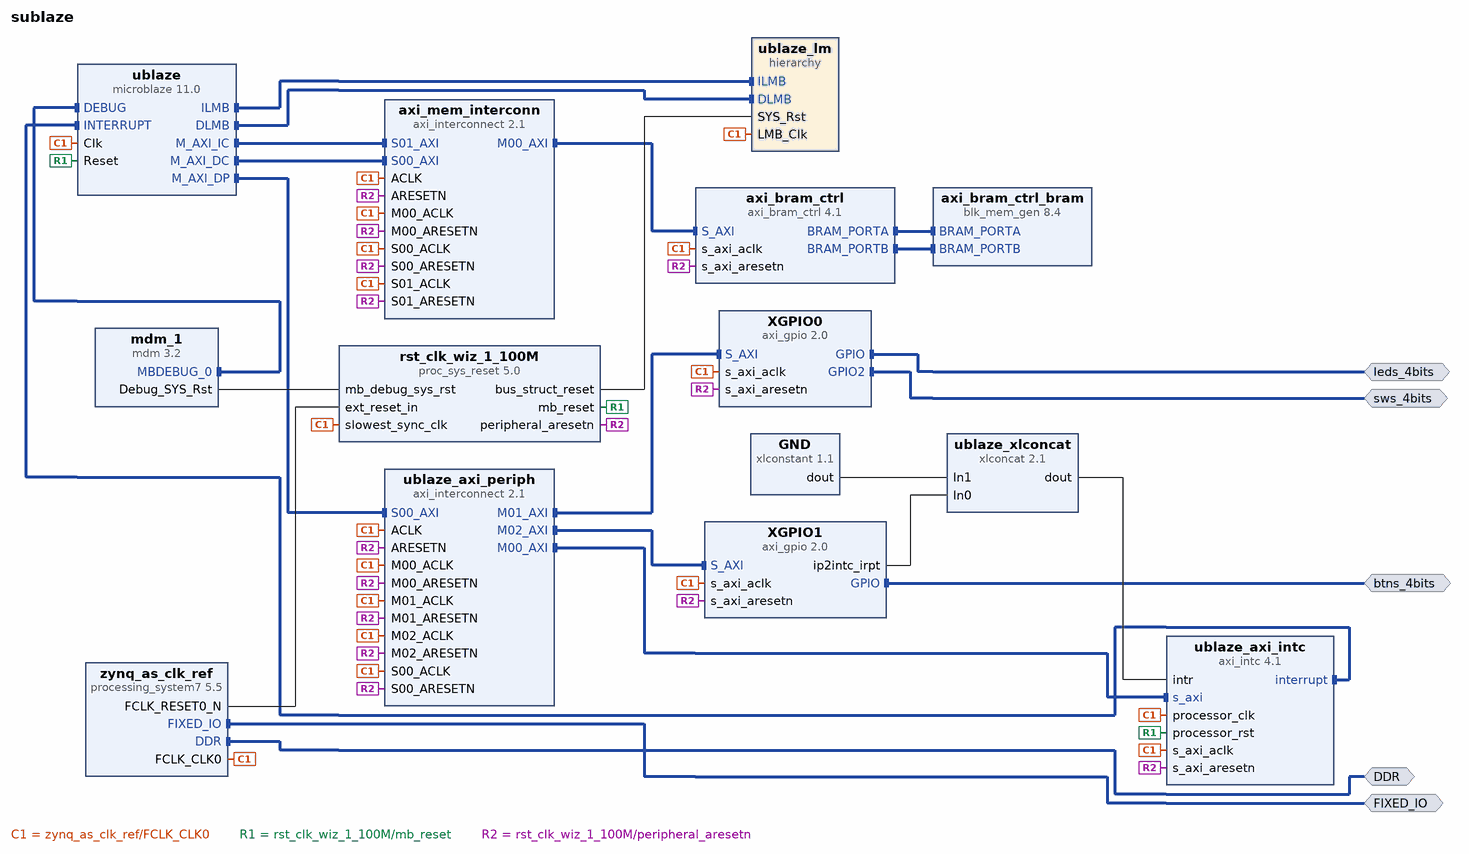
[diagram p0: block diagram of the top level]
# Vivado block design sublaze, xc7z010clg400-1, Vivado 2019.2
create_bd_design sublaze

create_bd_intf_port -mode Master -vlnv xilinx.com:interface:ddrx_rtl:1.0 DDR
create_bd_intf_port -mode Master -vlnv xilinx.com:display_processing_system7:fixedio_rtl:1.0 FIXED_IO
create_bd_intf_port -mode Master -vlnv xilinx.com:interface:gpio_rtl:1.0 sws_4bits
create_bd_intf_port -mode Master -vlnv xilinx.com:interface:gpio_rtl:1.0 leds_4bits
create_bd_intf_port -mode Master -vlnv xilinx.com:interface:gpio_rtl:1.0 btns_4bits

create_bd_cell -type ip -vlnv xilinx.com:ip:microblaze:11.0 ublaze
set_property -dict [list \
  CONFIG.C_ADDR_TAG_BITS 1 \
  CONFIG.C_CACHE_BYTE_SIZE 8192 \
  CONFIG.C_DCACHE_ADDR_TAG 1 \
  CONFIG.C_DCACHE_BYTE_SIZE 8192 \
  CONFIG.C_DCACHE_USE_WRITEBACK 1 \
  CONFIG.C_DEBUG_ENABLED 1 \
  CONFIG.C_DIV_ZERO_EXCEPTION 1 \
  CONFIG.C_D_AXI 1 \
  CONFIG.C_D_LMB 1 \
  CONFIG.C_FPU_EXCEPTION 1 \
  CONFIG.C_ICACHE_LINE_LEN 8 \
  CONFIG.C_ICACHE_STREAMS 1 \
  CONFIG.C_ICACHE_VICTIMS 8 \
  CONFIG.C_ILL_OPCODE_EXCEPTION 1 \
  CONFIG.C_I_LMB 1 \
  CONFIG.C_M_AXI_D_BUS_EXCEPTION 1 \
  CONFIG.C_M_AXI_I_BUS_EXCEPTION 1 \
  CONFIG.C_NUMBER_OF_PC_BRK 2 \
  CONFIG.C_NUMBER_OF_RD_ADDR_BRK 1 \
  CONFIG.C_NUMBER_OF_WR_ADDR_BRK 1 \
  CONFIG.C_OPCODE_0x0_ILLEGAL 1 \
  CONFIG.C_PVR 2 \
  CONFIG.C_UNALIGNED_EXCEPTIONS 1 \
  CONFIG.C_USE_BARREL 1 \
  CONFIG.C_USE_DCACHE 1 \
  CONFIG.C_USE_DIV 1 \
  CONFIG.C_USE_FPU 1 \
  CONFIG.C_USE_HW_MUL 2 \
  CONFIG.C_USE_ICACHE 1 \
  CONFIG.C_USE_MMU 0 \
  CONFIG.C_USE_MSR_INSTR 1 \
  CONFIG.C_USE_PCMP_INSTR 1 \
  CONFIG.G_TEMPLATE_LIST 10 \
  CONFIG.G_USE_EXCEPTIONS 1 \
] [get_bd_cells ublaze]
create_bd_cell -type hier ublaze_lm
create_bd_cell -type ip -vlnv xilinx.com:ip:axi_interconnect:2.1 ublaze_axi_periph
set_property -dict {CONFIG.NUM_MI 3} [get_bd_cells ublaze_axi_periph]
create_bd_cell -type ip -vlnv xilinx.com:ip:axi_intc:4.1 ublaze_axi_intc
set_property -dict {CONFIG.C_HAS_FAST 1 CONFIG.C_IRQ_IS_LEVEL 0} [get_bd_cells ublaze_axi_intc]
create_bd_cell -type ip -vlnv xilinx.com:ip:xlconcat:2.1 ublaze_xlconcat
create_bd_cell -type ip -vlnv xilinx.com:ip:mdm:3.2 mdm_1
create_bd_cell -type ip -vlnv xilinx.com:ip:proc_sys_reset:5.0 rst_clk_wiz_1_100M
create_bd_cell -type ip -vlnv xilinx.com:ip:axi_interconnect:2.1 axi_mem_interconn
set_property -dict {CONFIG.NUM_MI 1 CONFIG.NUM_SI 2} [get_bd_cells axi_mem_interconn]
create_bd_cell -type ip -vlnv xilinx.com:ip:axi_bram_ctrl:4.1 axi_bram_ctrl
create_bd_cell -type ip -vlnv xilinx.com:ip:blk_mem_gen:8.4 axi_bram_ctrl_bram
set_property -dict {CONFIG.Memory_Type True_Dual_Port_RAM} [get_bd_cells axi_bram_ctrl_bram]
create_bd_cell -type ip -vlnv xilinx.com:ip:processing_system7:5.5 zynq_as_clk_ref
set_property -dict [list \
  CONFIG.PCW_APU_PERIPHERAL_FREQMHZ 650 \
  CONFIG.PCW_CRYSTAL_PERIPHERAL_FREQMHZ 50.000000 \
  CONFIG.PCW_ENET0_PERIPHERAL_ENABLE 0 \
  CONFIG.PCW_FPGA0_PERIPHERAL_FREQMHZ 100 \
  CONFIG.PCW_FPGA1_PERIPHERAL_FREQMHZ 50 \
  CONFIG.PCW_GP0_EN_MODIFIABLE_TXN 0 \
  CONFIG.PCW_GP1_EN_MODIFIABLE_TXN 0 \
  CONFIG.PCW_GPIO_MIO_GPIO_ENABLE 0 \
  CONFIG.PCW_PERIPHERAL_BOARD_PRESET part0 \
  CONFIG.PCW_PRESET_BANK1_VOLTAGE {LVCMOS 1.8V} \
  CONFIG.PCW_QSPI_GRP_FBCLK_ENABLE 1 \
  CONFIG.PCW_QSPI_GRP_FBCLK_IO {MIO 8} \
  CONFIG.PCW_QSPI_GRP_SINGLE_SS_ENABLE 1 \
  CONFIG.PCW_QSPI_GRP_SINGLE_SS_IO {MIO 1 .. 6} \
  CONFIG.PCW_QSPI_PERIPHERAL_ENABLE 1 \
  CONFIG.PCW_QSPI_QSPI_IO {MIO 1 .. 6} \
  CONFIG.PCW_SD0_PERIPHERAL_ENABLE 0 \
  CONFIG.PCW_SDIO_PERIPHERAL_FREQMHZ 50 \
  CONFIG.PCW_SINGLE_QSPI_DATA_MODE x4 \
  CONFIG.PCW_UART1_PERIPHERAL_ENABLE 0 \
  CONFIG.PCW_UART_PERIPHERAL_FREQMHZ 100 \
  CONFIG.PCW_UIPARAM_DDR_FREQ_MHZ 525 \
  CONFIG.PCW_UIPARAM_DDR_PARTNO {MT41K128M16 JT-125} \
  CONFIG.PCW_USB0_PERIPHERAL_ENABLE 0 \
  CONFIG.PCW_USE_M_AXI_GP0 0 \
] [get_bd_cells zynq_as_clk_ref]
# 339 more settings of zynq_as_clk_ref are not shown: defaults, MIO pin electricals, DDR timing, and values the tool derives
create_bd_cell -type ip -vlnv xilinx.com:ip:axi_gpio:2.0 XGPIO0
set_property -dict [list \
  CONFIG.GPIO2_BOARD_INTERFACE sws_4bits \
  CONFIG.GPIO_BOARD_INTERFACE leds_4bits \
  CONFIG.USE_BOARD_FLOW true \
] [get_bd_cells XGPIO0]
create_bd_cell -type ip -vlnv xilinx.com:ip:axi_gpio:2.0 XGPIO1
set_property -dict [list \
  CONFIG.C_INTERRUPT_PRESENT 1 \
  CONFIG.C_IS_DUAL 0 \
  CONFIG.GPIO2_BOARD_INTERFACE Custom \
  CONFIG.GPIO_BOARD_INTERFACE btns_4bits \
  CONFIG.USE_BOARD_FLOW true \
] [get_bd_cells XGPIO1]
create_bd_cell -type ip -vlnv xilinx.com:ip:xlconstant:1.1 GND
set_property -dict {CONFIG.CONST_VAL 0} [get_bd_cells GND]

# ---- hierarchy /ublaze_lm ----
current_bd_instance /ublaze_lm
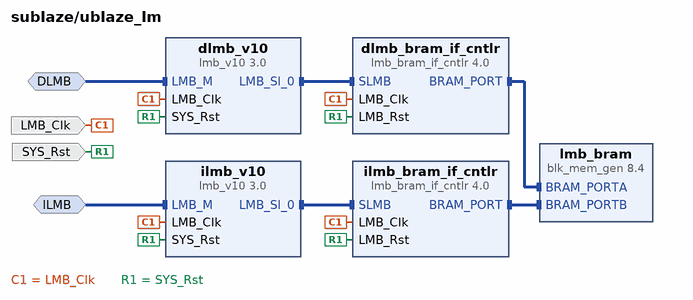
[diagram p1: block diagram inside /ublaze_lm]
create_bd_intf_pin -mode MirroredMaster -vlnv xilinx.com:interface:lmb_rtl:1.0 DLMB
create_bd_intf_pin -mode MirroredMaster -vlnv xilinx.com:interface:lmb_rtl:1.0 ILMB
create_bd_pin -dir I -type clk LMB_Clk
create_bd_pin -dir I -type rst SYS_Rst

create_bd_cell -type ip -vlnv xilinx.com:ip:lmb_v10:3.0 dlmb_v10
create_bd_cell -type ip -vlnv xilinx.com:ip:lmb_v10:3.0 ilmb_v10
create_bd_cell -type ip -vlnv xilinx.com:ip:lmb_bram_if_cntlr:4.0 dlmb_bram_if_cntlr
set_property -dict {CONFIG.C_ECC 0} [get_bd_cells dlmb_bram_if_cntlr]
create_bd_cell -type ip -vlnv xilinx.com:ip:lmb_bram_if_cntlr:4.0 ilmb_bram_if_cntlr
set_property -dict {CONFIG.C_ECC 0} [get_bd_cells ilmb_bram_if_cntlr]
create_bd_cell -type ip -vlnv xilinx.com:ip:blk_mem_gen:8.4 lmb_bram
set_property -dict {CONFIG.Memory_Type True_Dual_Port_RAM CONFIG.use_bram_block BRAM_Controller} [get_bd_cells lmb_bram]

# ---- connections ----

current_bd_instance /ublaze_lm
connect_bd_intf_net -intf_net ublaze_ilmb [get_bd_intf_pins ILMB] [get_bd_intf_pins ilmb_v10/LMB_M]
connect_bd_intf_net -intf_net ublaze_ilmb_cntlr [get_bd_intf_pins ilmb_bram_if_cntlr/BRAM_PORT] [get_bd_intf_pins lmb_bram/BRAM_PORTB]
connect_bd_intf_net -intf_net ublaze_dlmb_cntlr [get_bd_intf_pins dlmb_bram_if_cntlr/BRAM_PORT] [get_bd_intf_pins lmb_bram/BRAM_PORTA]
connect_bd_intf_net -intf_net ublaze_dlmb [get_bd_intf_pins DLMB] [get_bd_intf_pins dlmb_v10/LMB_M]
connect_bd_intf_net -intf_net ublaze_ilmb_bus [get_bd_intf_pins ilmb_v10/LMB_Sl_0] [get_bd_intf_pins ilmb_bram_if_cntlr/SLMB]
connect_bd_intf_net -intf_net ublaze_dlmb_bus [get_bd_intf_pins dlmb_v10/LMB_Sl_0] [get_bd_intf_pins dlmb_bram_if_cntlr/SLMB]
connect_bd_net -net ublaze_Clk [get_bd_pins LMB_Clk] \
  [get_bd_pins dlmb_v10/LMB_Clk] [get_bd_pins dlmb_bram_if_cntlr/LMB_Clk] [get_bd_pins ilmb_v10/LMB_Clk] \
  [get_bd_pins ilmb_bram_if_cntlr/LMB_Clk]
connect_bd_net [get_bd_pins SYS_Rst] \
  [get_bd_pins dlmb_v10/SYS_Rst] [get_bd_pins dlmb_bram_if_cntlr/LMB_Rst] [get_bd_pins ilmb_v10/SYS_Rst] \
  [get_bd_pins ilmb_bram_if_cntlr/LMB_Rst]
set_property HDL_ATTRIBUTE.BMM_INFO_ADDRESS_SPACE {byte  0x00000000 32 > sublaze ublaze_lm/lmb_bram} [get_bd_cells dlmb_bram_if_cntlr]
set_property HDL_ATTRIBUTE.KEEP_HIERARCHY yes [get_bd_cells dlmb_bram_if_cntlr]

current_bd_instance /
connect_bd_intf_net [get_bd_intf_pins ublaze_axi_periph/M01_AXI] [get_bd_intf_pins XGPIO0/S_AXI]
connect_bd_intf_net -intf_net ublaze_axi_dp [get_bd_intf_pins ublaze_axi_periph/S00_AXI] [get_bd_intf_pins ublaze/M_AXI_DP]
connect_bd_intf_net [get_bd_intf_pins axi_bram_ctrl_bram/BRAM_PORTA] [get_bd_intf_pins axi_bram_ctrl/BRAM_PORTA]
connect_bd_intf_net [get_bd_intf_pins axi_bram_ctrl_bram/BRAM_PORTB] [get_bd_intf_pins axi_bram_ctrl/BRAM_PORTB]
connect_bd_intf_net [get_bd_intf_pins axi_mem_interconn/M00_AXI] [get_bd_intf_pins axi_bram_ctrl/S_AXI]
connect_bd_intf_net [get_bd_intf_pins ublaze/M_AXI_IC] [get_bd_intf_pins axi_mem_interconn/S01_AXI]
connect_bd_intf_net [get_bd_intf_pins ublaze/M_AXI_DC] [get_bd_intf_pins axi_mem_interconn/S00_AXI]
connect_bd_intf_net [get_bd_intf_pins ublaze/ILMB] [get_bd_intf_pins ublaze_lm/ILMB]
connect_bd_intf_net -intf_net ublaze_intc_axi [get_bd_intf_pins ublaze_axi_periph/M00_AXI] [get_bd_intf_pins ublaze_axi_intc/s_axi]
connect_bd_intf_net [get_bd_intf_pins ublaze_axi_intc/interrupt] [get_bd_intf_pins ublaze/INTERRUPT]
connect_bd_intf_net [get_bd_intf_pins ublaze/DLMB] [get_bd_intf_pins ublaze_lm/DLMB]
connect_bd_intf_net [get_bd_intf_pins mdm_1/MBDEBUG_0] [get_bd_intf_pins ublaze/DEBUG]
connect_bd_intf_net -intf_net processing_system7_0_FIXED_IO [get_bd_intf_ports FIXED_IO] [get_bd_intf_pins zynq_as_clk_ref/FIXED_IO]
connect_bd_intf_net [get_bd_intf_ports leds_4bits] [get_bd_intf_pins XGPIO0/GPIO]
connect_bd_intf_net -intf_net axi_gpio_0_GPIO2 [get_bd_intf_ports sws_4bits] [get_bd_intf_pins XGPIO0/GPIO2]
connect_bd_intf_net -intf_net processing_system7_0_DDR [get_bd_intf_ports DDR] [get_bd_intf_pins zynq_as_clk_ref/DDR]
connect_bd_intf_net [get_bd_intf_ports btns_4bits] [get_bd_intf_pins XGPIO1/GPIO]
connect_bd_intf_net [get_bd_intf_pins ublaze_axi_periph/M02_AXI] [get_bd_intf_pins XGPIO1/S_AXI]
connect_bd_net -net ublaze_intr [get_bd_pins ublaze_xlconcat/dout] [get_bd_pins ublaze_axi_intc/intr]
connect_bd_net -net ublaze_Clk [get_bd_pins zynq_as_clk_ref/FCLK_CLK0] \
  [get_bd_pins ublaze/Clk] [get_bd_pins ublaze_axi_periph/ACLK] [get_bd_pins ublaze_axi_periph/S00_ACLK] \
  [get_bd_pins ublaze_axi_periph/M00_ACLK] [get_bd_pins ublaze_axi_intc/s_axi_aclk] \
  [get_bd_pins ublaze_axi_intc/processor_clk] [get_bd_pins ublaze_lm/LMB_Clk] \
  [get_bd_pins rst_clk_wiz_1_100M/slowest_sync_clk] [get_bd_pins axi_mem_interconn/S00_ACLK] \
  [get_bd_pins axi_bram_ctrl/s_axi_aclk] [get_bd_pins axi_mem_interconn/M00_ACLK] [get_bd_pins axi_mem_interconn/ACLK] \
  [get_bd_pins axi_mem_interconn/S01_ACLK] [get_bd_pins XGPIO0/s_axi_aclk] [get_bd_pins ublaze_axi_periph/M01_ACLK] \
  [get_bd_pins XGPIO1/s_axi_aclk] [get_bd_pins ublaze_axi_periph/M02_ACLK]
connect_bd_net [get_bd_pins rst_clk_wiz_1_100M/mb_reset] [get_bd_pins ublaze/Reset] [get_bd_pins ublaze_axi_intc/processor_rst]
connect_bd_net [get_bd_pins rst_clk_wiz_1_100M/bus_struct_reset] [get_bd_pins ublaze_lm/SYS_Rst]
connect_bd_net [get_bd_pins rst_clk_wiz_1_100M/peripheral_aresetn] \
  [get_bd_pins ublaze_axi_periph/ARESETN] [get_bd_pins ublaze_axi_periph/S00_ARESETN] \
  [get_bd_pins ublaze_axi_periph/M00_ARESETN] [get_bd_pins ublaze_axi_intc/s_axi_aresetn] \
  [get_bd_pins axi_mem_interconn/S00_ARESETN] [get_bd_pins axi_bram_ctrl/s_axi_aresetn] \
  [get_bd_pins axi_mem_interconn/M00_ARESETN] [get_bd_pins axi_mem_interconn/ARESETN] \
  [get_bd_pins axi_mem_interconn/S01_ARESETN] [get_bd_pins XGPIO0/s_axi_aresetn] [get_bd_pins ublaze_axi_periph/M01_ARESETN] \
  [get_bd_pins XGPIO1/s_axi_aresetn] [get_bd_pins ublaze_axi_periph/M02_ARESETN]
connect_bd_net [get_bd_pins mdm_1/Debug_SYS_Rst] [get_bd_pins rst_clk_wiz_1_100M/mb_debug_sys_rst]
connect_bd_net -net processing_system7_0_FCLK_RESET0_N [get_bd_pins zynq_as_clk_ref/FCLK_RESET0_N] [get_bd_pins rst_clk_wiz_1_100M/ext_reset_in]
connect_bd_net [get_bd_pins XGPIO1/ip2intc_irpt] [get_bd_pins ublaze_xlconcat/In0]
connect_bd_net -net xlconstant_0_dout [get_bd_pins GND/dout] [get_bd_pins ublaze_xlconcat/In1]
set_property HDL_ATTRIBUTE.BMM_INFO_PROCESSOR {microblaze-le > sublaze ublaze_lm/dlmb_bram_if_cntlr sublaze axi_bram_ctrl} [get_bd_cells ublaze]
set_property HDL_ATTRIBUTE.KEEP_HIERARCHY yes [get_bd_cells ublaze]
set_property HDL_ATTRIBUTE.BMM_INFO_ADDRESS_SPACE {byte  0xC0000000 32 > sublaze axi_bram_ctrl_bram} [get_bd_cells axi_bram_ctrl]
set_property HDL_ATTRIBUTE.KEEP_HIERARCHY yes [get_bd_cells axi_bram_ctrl]

# ---- address map ----
assign_bd_address -offset 0x00000000 -range 8K -target_address_space [get_bd_addr_spaces ublaze/Data] [get_bd_addr_segs ublaze_lm/dlmb_bram_if_cntlr/SLMB/Mem]
assign_bd_address -offset 0x40000000 -range 64K -target_address_space [get_bd_addr_spaces ublaze/Data] [get_bd_addr_segs XGPIO0/S_AXI/Reg]
assign_bd_address -offset 0x40010000 -range 64K -target_address_space [get_bd_addr_spaces ublaze/Data] [get_bd_addr_segs XGPIO1/S_AXI/Reg]
assign_bd_address -offset 0x41200000 -range 64K -target_address_space [get_bd_addr_spaces ublaze/Data] [get_bd_addr_segs ublaze_axi_intc/S_AXI/Reg]
assign_bd_address -offset 0xC0000000 -range 8K -target_address_space [get_bd_addr_spaces ublaze/Data] [get_bd_addr_segs axi_bram_ctrl/S_AXI/Mem0]
assign_bd_address -offset 0x00000000 -range 8K -target_address_space [get_bd_addr_spaces ublaze/Instruction] [get_bd_addr_segs ublaze_lm/ilmb_bram_if_cntlr/SLMB/Mem]
assign_bd_address -offset 0xC0000000 -range 8K -target_address_space [get_bd_addr_spaces ublaze/Instruction] [get_bd_addr_segs axi_bram_ctrl/S_AXI/Mem0]

validate_bd_design
save_bd_design
